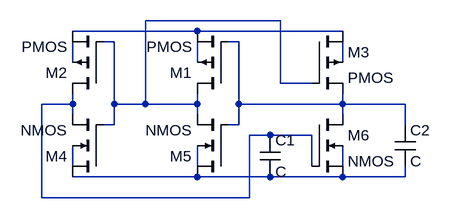
[diagram p0: schematic Draft1.asc]
Draft1.asc, the LTspice schematic file:
Version 4
SHEET 1 880 680
WIRE 512 208 304 208
WIRE 384 224 192 224
WIRE 608 224 384 224
WIRE 256 240 240 240
WIRE 448 240 432 240
WIRE 192 272 192 240
WIRE 384 272 384 240
WIRE 608 272 608 240
WIRE 512 304 512 208
WIRE 560 304 512 304
WIRE 192 336 192 320
WIRE 192 336 144 336
WIRE 256 336 256 240
WIRE 304 336 304 208
WIRE 304 336 256 336
WIRE 384 336 384 320
WIRE 384 336 304 336
WIRE 448 336 448 240
WIRE 608 336 608 320
WIRE 608 336 448 336
WIRE 704 336 608 336
WIRE 192 352 192 336
WIRE 384 352 384 336
WIRE 608 352 608 336
WIRE 256 368 256 336
WIRE 256 368 240 368
WIRE 448 368 448 336
WIRE 448 368 432 368
WIRE 704 368 704 336
WIRE 496 384 464 384
WIRE 560 384 496 384
WIRE 192 432 192 400
WIRE 384 432 384 400
WIRE 560 432 560 384
WIRE 608 432 608 400
WIRE 384 448 192 448
WIRE 496 448 384 448
WIRE 608 448 496 448
WIRE 704 448 704 432
WIRE 704 448 608 448
WIRE 144 480 144 336
WIRE 464 480 464 384
WIRE 464 480 144 480
SYMBOL pmos4 432 320 R180
SYMATTR InstName M1
SYMATTR Value2 l=180n
SYMBOL pmos4 240 320 R180
SYMATTR InstName M2
SYMATTR Value2 l=180n
SYMBOL pmos4 560 224 R0
SYMATTR InstName M3
SYMATTR Value2 l=180n
SYMBOL nmos4 240 448 R180
SYMATTR InstName M4
SYMATTR Value2 l=180n
SYMBOL nmos4 432 448 R180
SYMATTR InstName M5
SYMATTR Value2 l=180n
SYMBOL nmos4 560 352 R0
SYMATTR InstName M6
SYMATTR Value2 l=180n
SYMBOL Cap 480 384 R0
SYMATTR InstName C1
SYMBOL Cap 688 368 R0
SYMATTR InstName C2

The netlist it stands for:
* Draft1.asc
M1 N001 N003 N002 N005 PMOS l=180n
M2 N007 N001 N002 N004 PMOS l=180n
M3 N002 N001 N003 N006 PMOS l=180n
M4 N011 N001 N007 N008 NMOS l=180n
M5 N011 N003 N001 N009 NMOS l=180n
M6 N003 N007 N011 N010 NMOS l=180n
C1 N007 N011 C
C2 N003 N011 C
.model NMOS NMOS
.model PMOS PMOS
.lib standard.mos
.backanno
.end